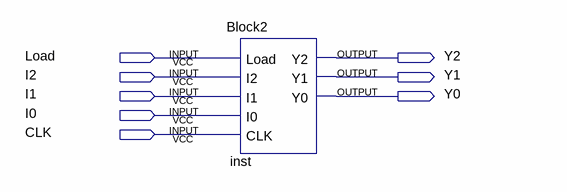
[diagram p0: schematic sheet]
// Quartus schematic Block3.bdf as structural Verilog: 1 symbols, 8 pins
module Block3 (
  input  Load,
  input  I2,
  input  I1,
  input  I0,
  input  CLK,
  output Y2,
  output Y1,
  output Y0
);

  Block2 inst (.Load(Load), .I2(I2), .I1(I1), .I0(I0), .CLK(CLK), .Y2(Y2), .Y1(Y1), .Y0(Y0));
endmodule
